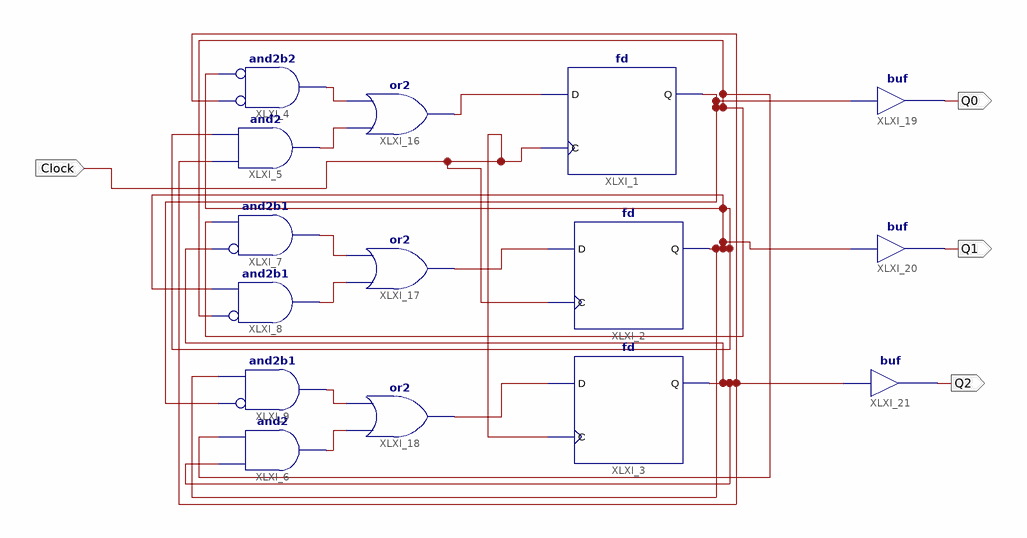
[diagram p0: schematic sheet 1]
// Xilinx ISE schematic schematLicznik.sch (artix7) as structural Verilog: 15 symbols, 4 ports
module schematLicznik (
  input  Clock,
  output Q0,
  output Q1,
  output Q2
);

  wire XLXN_1, XLXN_2, XLXN_3, XLXN_4, XLXN_6, XLXN_7, XLXN_8, XLXN_9, XLXN_10, XLXN_19, XLXN_21, XLXN_22;

  fd XLXI_1 (.C(Clock), .D(XLXN_3), .Q(XLXN_21));
  fd XLXI_2 (.C(Clock), .D(XLXN_7), .Q(XLXN_19));
  fd XLXI_3 (.C(Clock), .D(XLXN_10), .Q(XLXN_22));
  and XLXI_4 (XLXN_1, ~XLXN_22, ~XLXN_19);  // and2b2
  and XLXI_5 (XLXN_2, XLXN_22, XLXN_19);
  and XLXI_6 (XLXN_9, XLXN_22, XLXN_21);
  and XLXI_7 (XLXN_4, ~XLXN_22, XLXN_21);  // and2b1
  and XLXI_8 (XLXN_6, ~XLXN_21, XLXN_19);  // and2b1
  and XLXI_9 (XLXN_8, ~XLXN_21, XLXN_19);  // and2b1
  or XLXI_16 (XLXN_3, XLXN_2, XLXN_1);
  or XLXI_17 (XLXN_7, XLXN_6, XLXN_4);
  or XLXI_18 (XLXN_10, XLXN_9, XLXN_8);
  buf XLXI_19 (Q0, XLXN_21);
  buf XLXI_20 (Q1, XLXN_19);
  buf XLXI_21 (Q2, XLXN_22);
endmodule
